# Altium schematic sheet Volant5.PIC32MX_circuit_1.0.SchDoc
size A4
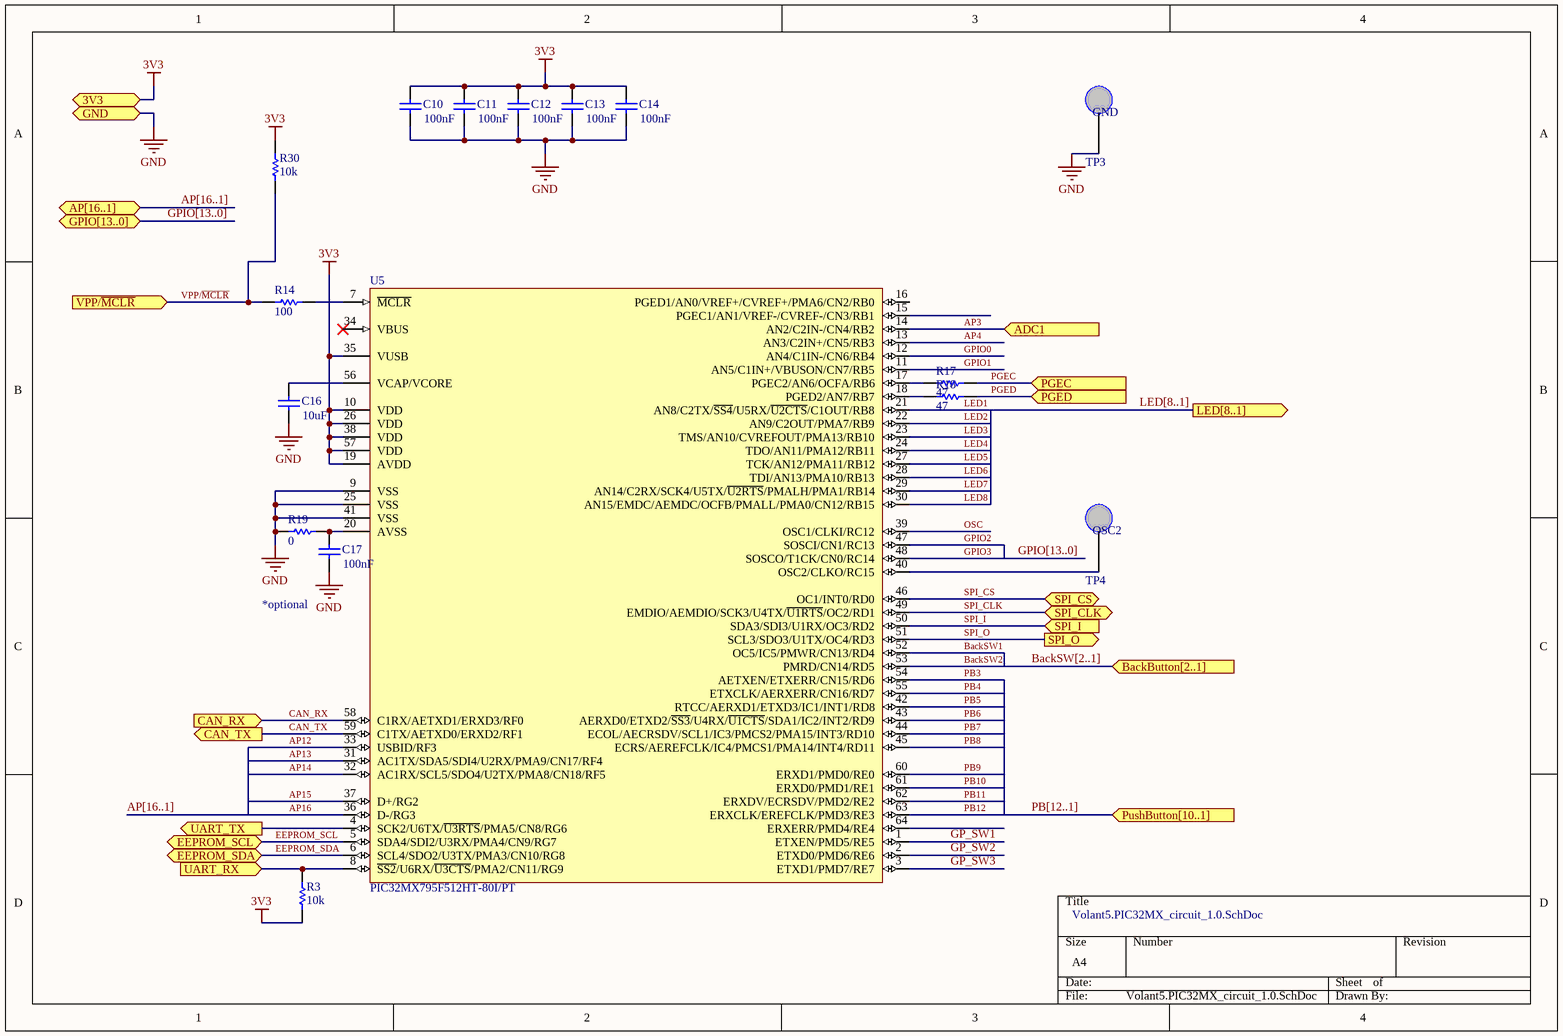
[diagram p0: Volant5.PIC32MX_circuit_1.0.SchDoc]

## Parts
C10  value 100nF  [CS-0603]  (hidden comment: CS - CAPACITOR)
C11  value 100nF  [CS-0603]  (hidden comment: CS - CAPACITOR)
C12  value 100nF  [CS-0603]  (hidden comment: CS - CAPACITOR)
C13  value 100nF  [CS-0603]  (hidden comment: CS - CAPACITOR)
C14  value 100nF  [CS-0603]  (hidden comment: CS - CAPACITOR)
C16  value 10uF  [CS-0603]  (hidden comment: CS - CAPACITOR)
C17  value 100nF  [CS-0603]  (hidden comment: CS - CAPACITOR)
R3  value 10k  [RS-0402]  (hidden comment: RS - RESISTOR)
R14  value 100  [RS-0603]  (hidden comment: RS - RESISTOR)
R17  value 47  [RS-0603]  (hidden comment: RS - RESISTOR)
R18  value 47  [RS-0603]  (hidden comment: RS - RESISTOR)
R19  value 0  [RS-0603]  (hidden comment: RS - RESISTOR)
R30  value 10k  [RS-0603]  (hidden comment: RS - RESISTOR)
TP3  GND  [TP - VERTICAL]
TP4  OSC2  [TP - VERTICAL]
U5  PIC32MX795F512HT-80I/PT  [IC-TQFP-64]

## Ports
3V3, ADC1 (in), AP[16..1] (bidir), BackButton[2..1] (in), CAN_RX (in), CAN_TX (out), EEPROM_SCL (bidir), EEPROM_SDA (bidir), GND, GPIO[13..0] (bidir), LED[8..1] (out), PGEC (in), PGED (in), PushButton[10..1] (in), SPI_CLK, SPI_CS, SPI_I (in), SPI_O (out), UART_RX (in), UART_TX (out), VPP/~{MCLR} (in)

## Nets
3V3: C10.2 C11.2 C12.2 C13.2 C14.2 R3.1 R30.2 U5.10(VDD) U5.19(AVDD) U5.26(VDD) U5.35(VUSB) U5.38(VDD) U5.57(VDD) ; port 3V3
GND: C10.1 C11.1 C12.1 C13.1 C14.1 C16.1 C17.1 R19.2 TP3.1 U5.9(VSS) U5.25(VSS) U5.41(VSS) ; port GND
AP3: U5.14(AN2/C2IN-/CN4/RB2) ; port ADC1
AP4: U5.13(AN3/C2IN+/CN5/RB3)
AP12: U5.33(USBID/RF3)
AP13: U5.31(AC1TX/SDA5/SDI4/U2RX/PMA9/CN17/RF4)
AP14: U5.32(AC1RX/SCL5/SDO4/U2TX/PMA8/CN18/RF5)
AP15: U5.37(D+/RG2)
AP16: U5.36(D-/RG3)
BackSW1: U5.52(OC5/IC5/PMWR/CN13/RD4)
BackSW2: U5.53(PMRD/CN14/RD5)
CAN_RX: U5.58(C1RX/AETXD1/ERXD3/RF0) ; port CAN_RX
CAN_TX: U5.59(C1TX/AETXD0/ERXD2/RF1) ; port CAN_TX
EEPROM_SCL: U5.5(SDA4/SDI2/U3RX/PMA4/CN9/RG7) ; port EEPROM_SCL
EEPROM_SDA: U5.6(SCL4/SDO2/U3TX/PMA3/CN10/RG8) ; port EEPROM_SDA
GP_SW1: U5.1(ETXEN/PMD5/RE5)
GP_SW2: U5.2(ETXD0/PMD6/RE6)
GP_SW3: U5.3(ETXD1/PMD7/RE7)
GPIO0: U5.12(AN4/C1IN-/CN6/RB4)
GPIO1: U5.11(AN5/C1IN+/VBUSON/CN7/RB5)
GPIO2: U5.47(SOSCI/CN1/RC13)
GPIO3: U5.48(SOSCO/T1CK/CN0/RC14)
LED1: U5.21(AN8/C2TX/~{SS4}/U5RX/~{U2CTS}/C1OUT/RB8)
LED2: U5.22(AN9/C2OUT/PMA7/RB9)
LED3: U5.23(TMS/AN10/CVREFOUT/PMA13/RB10)
LED4: U5.24(TDO/AN11/PMA12/RB11)
LED5: U5.27(TCK/AN12/PMA11/RB12)
LED6: U5.28(TDI/AN13/PMA10/RB13)
LED7: U5.29(AN14/C2RX/SCK4/U5TX/~{U2RTS}/PMALH/PMA1/RB14)
LED8: U5.30(AN15/EMDC/AEMDC/OCFB/PMALL/PMA0/CN12/RB15)
OSC: U5.39(OSC1/CLKI/RC12)
PB3: U5.54(AETXEN/ETXERR/CN15/RD6)
PB4: U5.55(ETXCLK/AERXERR/CN16/RD7)
PB5: U5.42(RTCC/AERXD1/ETXD3/IC1/INT1/RD8)
PB6: U5.43(AERXD0/ETXD2/~{SS3}/U4RX/~{U1CTS}/SDA1/IC2/INT2/RD9)
PB7: U5.44(ECOL/AECRSDV/SCL1/IC3/PMCS2/PMA15/INT3/RD10)
PB8: U5.45(ECRS/AEREFCLK/IC4/PMCS1/PMA14/INT4/RD11)
PB9: U5.60(ERXD1/PMD0/RE0)
PB10: U5.61(ERXD0/PMD1/RE1)
PB11: U5.62(ERXDV/ECRSDV/PMD2/RE2)
PB12: U5.63(ERXCLK/EREFCLK/PMD3/RE3)
PGEC: R17.1 ; port PGEC
PGED: R18.1 ; port PGED
SPI_CLK: U5.49(EMDIO/AEMDIO/SCK3/U4TX/~{U1RTS}/OC2/RD1) ; port SPI_CLK
SPI_CS: U5.46(OC1/INT0/RD0) ; port SPI_CS
SPI_I: U5.50(SDA3/SDI3/U1RX/OC3/RD2) ; port SPI_I
SPI_O: U5.51(SCL3/SDO3/U1TX/OC4/RD3) ; port SPI_O
UART_RX: R3.2 U5.8(~{SS2}/U6RX/~{U3CTS}/PMA2/CN11/RG9) ; port UART_RX
UART_TX: U5.4(SCK2/U6TX/~{U3RTS}/PMA5/CN8/RG6) ; port UART_TX
VPP/~{MCLR}: R14.2 R30.1 ; port VPP/~{MCLR}
NetC16_2: C16.2 U5.56(VCAP/VCORE)
NetC17_2: C17.2 R19.1 U5.20(AVSS)
NetR14_1: R14.1 U5.7(~{MCLR})
NetR17_2: R17.2 U5.17(PGEC2/AN6/OCFA/RB6)
NetR18_2: R18.2 U5.18(PGED2/AN7/RB7)
NetTP4_1: TP4.1 U5.40(OSC2/CLKO/RC15)

Not connected (* = marked no-connect by the designer): U5 15(PGEC1/AN1/VREF-/CVREF-/CN3/RB1) 16(PGED1/AN0/VREF+/CVREF+/PMA6/CN2/RB0) 34(VBUS)* 64(ERXERR/PMD4/RE4)

## Buses and harness runs
bus AP[16..1]
bus AP[16..1] = port AP[16..1]
bus BackSW[2..1] = port BackButton[2..1]
bus GPIO[13..0]
bus GPIO[13..0] = port GPIO[13..0]
bus LED[8..1] = port LED[8..1]
bus PB[12..1] = port PushButton[10..1]

## Notes on the sheet
- *optional

## Library data of the parts
C10-C14 C16 C17 = CS - CAPACITOR: TOLERANCE: 10%; Supplier 1: *; (FIELD A): *; (FLIED C): *; (FIELD B): *; Manufacturer: *
  C10-C14 C17: Supplier Part Number 1: 490-1532-1-ND
  C16: Supplier Part Number 1: 587-3238-1-ND
R3 R14 R17-R19 R30 = RS - RESISTOR: TOLERANCE: RES TOL; POWER: RES POWER; Supplier 1: *; (FIELD A): *; (FLIED C): *; (FIELD B): *; Manufacturer: *
  R3 R30: Supplier Part Number 1: *
  R14: Supplier Part Number 1: P100GCT-ND
  R17 R18: Supplier Part Number 1: 1276-4539-1-ND
  R19: Supplier Part Number 1: P0.0GCT-ND
TP3 TP4 = TP - Test point vertical: (FIELD A): *; (FIELD B): *; (FIELD C): *; Manufacturer: *; Supplier 1: Newark; Supplier Part Number 1: 62W5140
U5 = IC - PIC32MX795F512HT-80I/PT: Manufacturer: Microchip; (FLIED A): *; (FLIED B): *; (FLIED C): *; Supplier 1: Digi-Key; Supplier Part Number 1: PIC32MX795F512H-80I/PT-ND